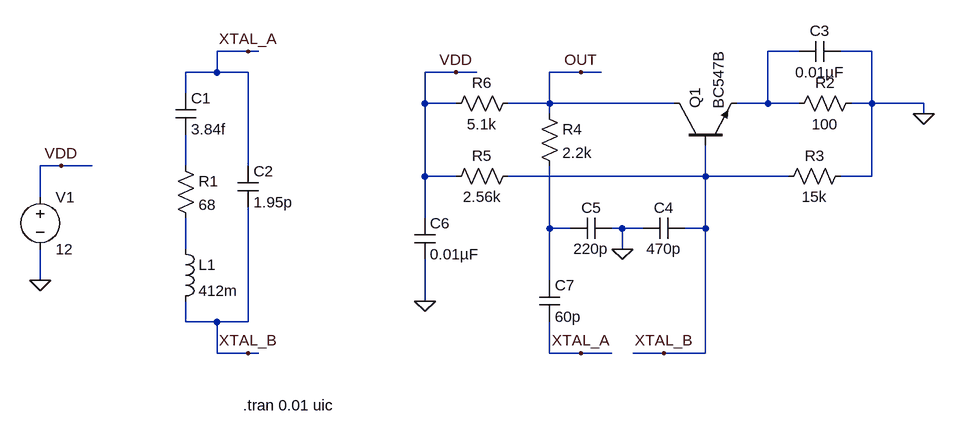
[diagram p0: schematic Draft1.asc]
Draft1.asc, the LTspice schematic file:
Version 4
SHEET 1 880 680
WIRE -480 -80 -528 -80
WIRE -464 -80 -480 -80
WIRE 368 -80 320 -80
WIRE 480 -80 432 -80
WIRE -528 -48 -528 -80
WIRE -528 -48 -576 -48
WIRE -480 -48 -528 -48
WIRE -160 -48 -208 -48
WIRE -128 -48 -160 -48
WIRE 32 -48 -16 -48
WIRE 64 -48 32 -48
WIRE -576 -16 -576 -48
WIRE -208 0 -208 -48
WIRE -160 0 -208 0
WIRE -16 0 -16 -48
WIRE -16 0 -80 0
WIRE 176 0 -16 0
WIRE 320 0 320 -80
WIRE 320 0 272 0
WIRE 368 0 320 0
WIRE 480 0 480 -80
WIRE 480 0 448 0
WIRE 560 0 480 0
WIRE -16 16 -16 0
WIRE 560 16 560 0
WIRE -768 96 -800 96
WIRE -720 96 -768 96
WIRE -576 96 -576 48
WIRE -480 96 -480 -48
WIRE -208 112 -208 0
WIRE -160 112 -208 112
WIRE 224 112 224 64
WIRE 224 112 -80 112
WIRE 352 112 224 112
WIRE 480 112 480 0
WIRE 480 112 432 112
WIRE -800 144 -800 96
WIRE -208 176 -208 112
WIRE -16 192 -16 96
WIRE 16 192 -16 192
WIRE 96 192 80 192
WIRE 128 192 96 192
WIRE 224 192 224 112
WIRE 224 192 192 192
WIRE -576 224 -576 176
WIRE 96 224 96 192
WIRE -800 272 -800 224
WIRE -16 272 -16 192
WIRE -208 304 -208 240
WIRE -576 336 -576 304
WIRE -528 336 -576 336
WIRE -480 336 -480 160
WIRE -480 336 -528 336
WIRE -528 384 -528 336
WIRE -480 384 -528 384
WIRE -464 384 -480 384
WIRE -16 384 -16 336
WIRE 32 384 -16 384
WIRE 80 384 32 384
WIRE 160 384 112 384
WIRE 224 384 224 192
WIRE 224 384 160 384
FLAG -480 -80 XTAL_A
FLAG -480 384 XTAL_B
FLAG -768 96 VDD
FLAG -800 272 0
FLAG 560 16 0
FLAG 32 -48 OUT
FLAG -208 304 0
FLAG 96 224 0
FLAG -160 -48 VDD
FLAG 32 384 XTAL_A
FLAG 160 384 XTAL_B
SYMBOL cap -592 -16 R0
SYMATTR InstName C1
SYMATTR Value 3.84f
SYMBOL res -592 80 R0
SYMATTR InstName R1
SYMATTR Value 68
SYMBOL ind -592 208 R0
SYMATTR InstName L1
SYMATTR Value 412m
SYMBOL cap -496 96 R0
SYMATTR InstName C2
SYMATTR Value 1.95p
SYMBOL voltage -800 128 R0
WINDOW 123 0 0 Left 0
WINDOW 39 0 0 Left 0
SYMATTR InstName V1
SYMATTR Value 12
SYMBOL npn 176 64 R270
SYMATTR InstName Q1
SYMATTR Value BC547B
SYMBOL res 464 -16 R90
WINDOW 0 0 56 VBottom 2
WINDOW 3 32 56 VTop 2
SYMATTR InstName R2
SYMATTR Value 100
SYMBOL cap 368 -96 M90
WINDOW 0 0 32 VBottom 2
WINDOW 3 32 32 VTop 2
SYMATTR InstName C3
SYMATTR Value 0.01µF
SYMBOL res 448 96 R90
WINDOW 0 0 56 VBottom 2
WINDOW 3 32 56 VTop 2
SYMATTR InstName R3
SYMATTR Value 15k
SYMBOL cap 192 176 R90
WINDOW 0 0 32 VBottom 2
WINDOW 3 32 32 VTop 2
SYMATTR InstName C4
SYMATTR Value 470p
SYMBOL cap 80 176 R90
WINDOW 0 0 32 VBottom 2
WINDOW 3 32 32 VTop 2
SYMATTR InstName C5
SYMATTR Value 220p
SYMBOL res -32 0 R0
SYMATTR InstName R4
SYMATTR Value 2.2k
SYMBOL res -64 96 R90
WINDOW 0 0 56 VBottom 2
WINDOW 3 32 56 VTop 2
SYMATTR InstName R5
SYMATTR Value 2.56k
SYMBOL res -64 -16 R90
WINDOW 0 0 56 VBottom 2
WINDOW 3 32 56 VTop 2
SYMATTR InstName R6
SYMATTR Value 5.1k
SYMBOL cap -224 176 R0
SYMATTR InstName C6
SYMATTR Value 0.01µF
SYMBOL cap -32 272 R0
SYMATTR InstName C7
SYMATTR Value 60p
TEXT -488 464 Left 2 !.tran 0.01 uic

The netlist it stands for:
* Draft1.asc
C1 XTAL_A N002 3.84f
R1 N002 N004 68
L1 N004 XTAL_B 412m
C2 XTAL_A XTAL_B 1.95p
V1 VDD 0 12
Q1 OUT XTAL_B N001 0 BC547B
R2 0 N001 100
C3 N001 0 0.01µF
R3 0 XTAL_B 15k
C4 XTAL_B 0 470p
C5 0 N003 220p
R4 OUT N003 2.2k
R5 XTAL_B VDD 2.56k
R6 OUT VDD 5.1k
C6 VDD 0 0.01µF
C7 N003 XTAL_A 60p
.model NPN NPN
.model PNP PNP
.lib standard.bjt
.tran 0.01 uic
.backanno
.end